# Altium schematic sheet Interface.SchDoc
size Letter
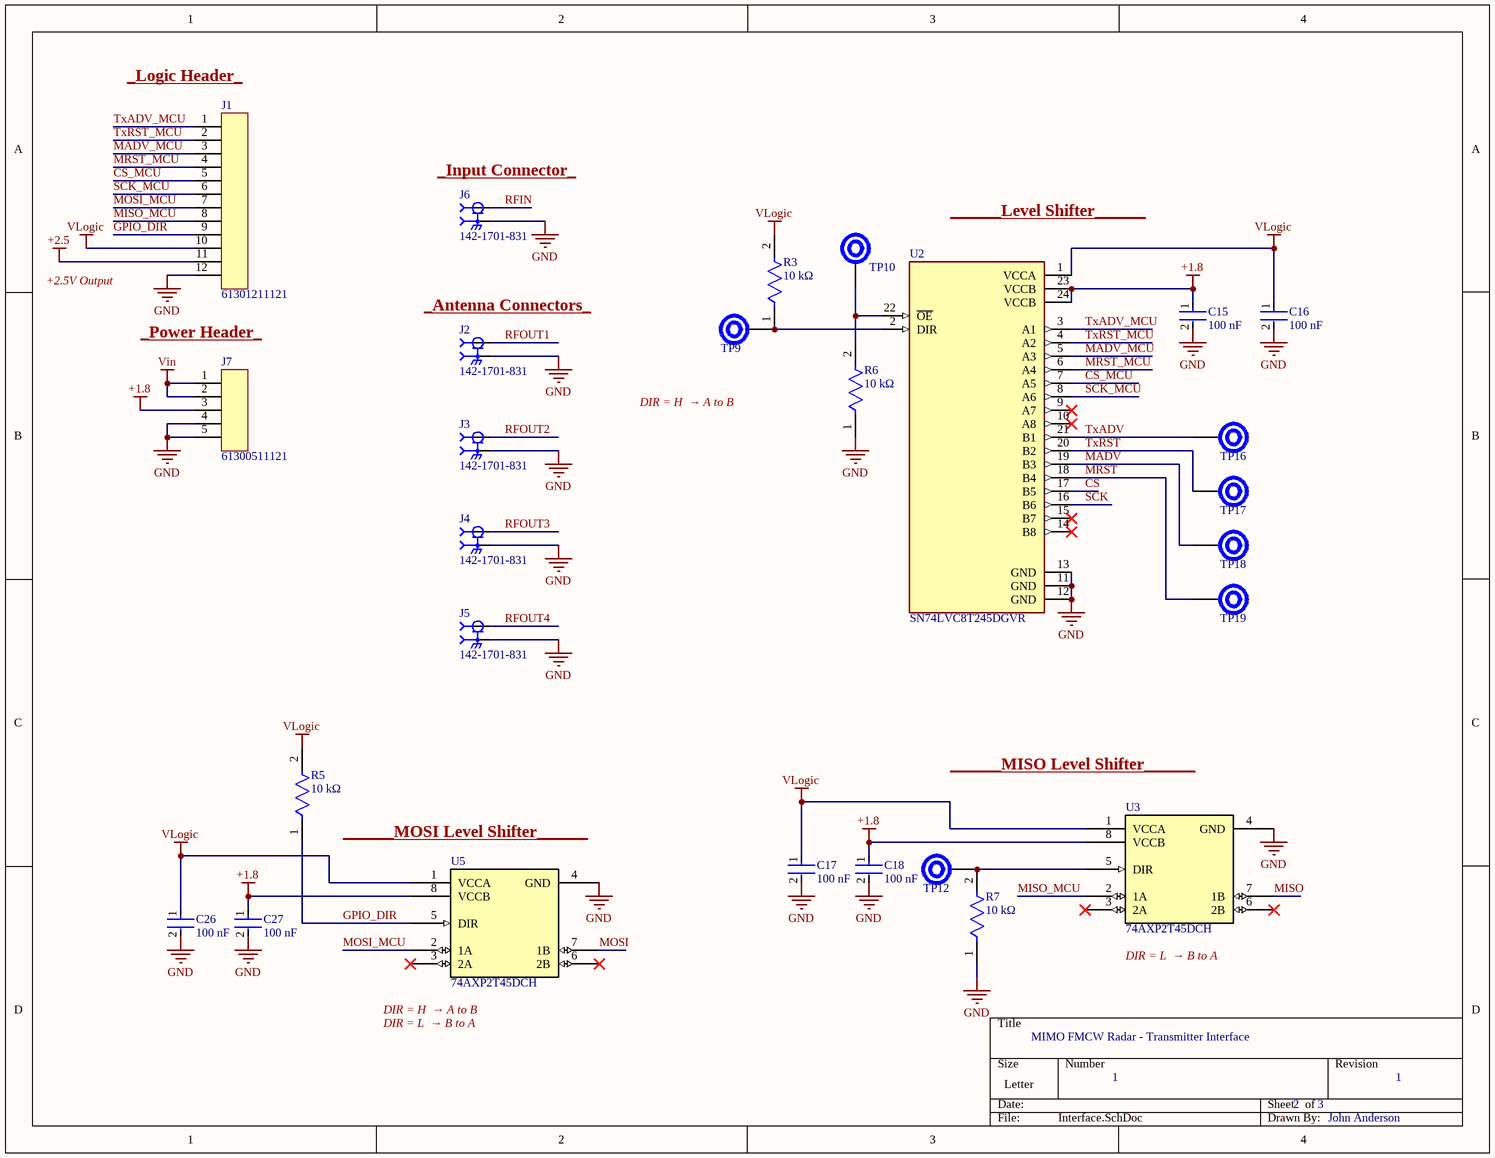
[diagram p0: Interface.SchDoc]

## Parts
C15  100 nF  [FP-CGA3E-0_3-0_1-MFG]
C16  100 nF  [FP-CGA3E-0_3-0_1-MFG]
C17  100 nF  [FP-CGA3E-0_3-0_1-MFG]
C18  100 nF  [FP-CGA3E-0_3-0_1-MFG]
C26  100 nF  [FP-CGA3E-0_3-0_1-MFG]
C27  100 nF  [FP-CGA3E-0_3-0_1-MFG]
J1  61301211121  [61301211121]
J2  142-1701-831  [142-1701-831-Footprint-1]
J3  142-1701-831  [142-1701-831-Footprint-1]
J4  142-1701-831  [142-1701-831-Footprint-1]
J5  142-1701-831  [142-1701-831-Footprint-1]
J6  142-1701-831  [142-1701-831-Footprint-1]
J7  61300511121  [61300511121]
R3  10 kΩ  [FP-RC0603-0_55-IPC_C]
R5  10 kΩ  [FP-RC0603-0_55-IPC_C]
R6  10 kΩ  [FP-RC0603-0_55-IPC_C]
R7  10 kΩ  [FP-RC0603-0_55-IPC_C]
TP9  Test Point - 32 mil  [Test Point - 32 mil-Footprint-1]  (value not drawn)
TP10  Test Point - 32 mil  [Test Point - 32 mil-Footprint-1]  (value not drawn)
TP12  Test Point - 32 mil  [Test Point - 32 mil-Footprint-1]  (value not drawn)
TP16  Test Point - 32 mil  [Test Point - 32 mil-Footprint-1]  (value not drawn)
TP17  Test Point - 32 mil  [Test Point - 32 mil-Footprint-1]  (value not drawn)
TP18  Test Point - 32 mil  [Test Point - 32 mil-Footprint-1]  (value not drawn)
TP19  Test Point - 32 mil  [Test Point - 32 mil-Footprint-1]  (value not drawn)
U2  SN74LVC8T245DGVR  [SN74LVC8T245DGVR-Footprint-1]
U3  74AXP2T45DCH  [74AXP2T45DCH-Footprint-1]
U5  74AXP2T45DCH  [74AXP2T45DCH-Footprint-1]

## Nets
+1.8: C15.1 C18.1 C27.1 J7.3 U2.23(VCCB) U2.24(VCCB) U3.8(VCCB) U5.8(VCCB)
+2.5: J1.11
GND: C15.2 C16.2 C17.2 C18.2 C26.2 C27.2 J1.12 J2.2(GND) J3.2(GND) J4.2(GND) J5.2(GND) J6.2(GND) J7.4 J7.5 R6.1 R7.1 U2.11(GND) U2.12(GND) U2.13(GND) U3.4(GND) U5.4(GND)
Vin: J7.1 J7.2
VLogic: C16.1 C17.1 C26.1 J1.10 R3.2 R5.2 U2.1(VCCA) U3.1(VCCA) U5.1(VCCA)
CS: U2.17(B5)
CS_MCU: J1.5 U2.7(A5)
GPIO_DIR: J1.9 R5.1 U5.5(DIR)
MADV: TP18.1 U2.19(B3)
MADV_MCU: J1.3 U2.5(A3)
MISO: U3.7(1B)
MISO_MCU: J1.8 U3.2(1A)
MOSI: U5.7(1B)
MOSI_MCU: J1.7 U5.2(1A)
MRST: TP19.1 U2.18(B4)
MRST_MCU: J1.4 U2.6(A4)
RFIN: J6.1(SIG)
RFOUT1: J2.1(SIG)
RFOUT2: J3.1(SIG)
RFOUT3: J4.1(SIG)
RFOUT4: J5.1(SIG)
SCK: U2.16(B6)
SCK_MCU: J1.6 U2.8(A6)
TxADV: TP16.1 U2.21(B1)
TxADV_MCU: J1.1 U2.3(A1)
TxRST: TP17.1 U2.20(B2)
TxRST_MCU: J1.2 U2.4(A2)
NetR3_1: R3.1 TP9.1 U2.2(DIR)
NetR6_2: R6.2 TP10.1 U2.22(~{OE})
NetR7_2: R7.2 TP12.1 U3.5(DIR)

Not connected (* = marked no-connect by the designer): U2 9(A7)* 10(A8)* 14(B8)* 15(B7)*; U3 3(2A)* 6(2B)*; U5 3(2A)* 6(2B)*

## Notes on the sheet
- (near J1) _Logic Header_
- (near J6) _Input Connector_
- ______Level Shifter______
- +2.5V Output
- _Power Header_
- (near J2) _Antenna Connectors_
- DIR = H  → A to B
- ______MISO Level Shifter______
- ______MOSI Level Shifter______
- (near U3) DIR = L  → B to A
- DIR = L  → B to A
- (near U5) DIR = H  → A to B
- MIMO FMCW Radar - Transmitter Interface
- 1
- 2
- 3
- John Anderson

## Library data of the parts
C15-C18 C26 C27 = CMP-00054-1: Ceramic Capacitor, Multilayer, Ceramic, 50V, 10% +Tol, 10% -Tol, X7R, 15% TC, 0.1uF, Surface Mount, 0603; Reference Standard: AEC-Q200; Value: 100nF; Multilayer: Yes; Min Operating Temperature: -55°C; Reach SVHC Compliant: Yes; Case/Package: 0603; Width: 0.8mm; Dielectric Material: Ceramic; Pins: 2; JESD-609 Code: e3; Package Style: SMTMeter; Capacitor Type: Ceramic; Mounting Technology: Surface Mount; Tolerance  (fill in as +-): 10%; Max Operating Temperature: 125°C; Packaging: Tape and Reel; Tolerance (fill in as +-): 10%; Terminal Finish: Nickel; Termination: Wraparound; Height: 0.8mm; Temperature Characteristics Code: X7R; Rated DC Voltage (URdc): 50V; Length: 1.6mm; Package Shape: Rectangular; RoHS Compliant: Yes
J1 = CMP-00202-1: THT Vertical Pin Header WR-PHD, Pitch 2.54 mm, Single Row, 12 pins; Number of Positions: 12; Current Rating: 3A; Connector Type: Male Pin; Pitch: 2.54mm; Contact Resistance: 20mΩ; Gender: Male; Operating Supply Voltage: 250V; Color: Black; Contact Plating: Gold; Packaging: Bulk; Mounting Technology: Through Hole; Contact Mating Length: 5.9944mm; Number of Rows: 1; Contact Material: Copper; Number of Contacts: 12; Lead Pitch: 2.54mm; Orientation: Vertical; Pins: 12; Termination: Solder; RoHS: Compliant
J2-J6 = CMP-00382-1: RF SMA Connector, 1 Contact(s), Female, Board Mount, Surface Mount Terminal, Locking, Jack; Polarity: Standard; Insertion Loss (dB): 0.55dB; Insulation Resistance: 1GΩ; Connector Type: SMA, Socket; Body Plating: Gold; Clock Frequency: 26.5GHz; Impedance: 50Ω; Voltage Rating: 170V; Body Material: Brass; Contact Resistance: 4mΩ; Number of Ports: 1; Gender: Male; Dielectric Material: PTFE; Min Operating Temperature: -65°C; Case/Package: SMA; Contact Gender: Female; Shell Material: Brass; RoHS: Compliant; Harmonized Tariff Schedule (HTS) Code: 8536.69.40.10; Introduction Date: 2010-04-24; Orientation: Straight; Lifecycle Status: Production; Contact Material: Copper; Max Operating Temperature: 165°C; Pins: 1; Fastening Type: Threaded; Termination: Solder; Mounting Technology: Edge; Contact Plating: Gold; Export Control Classification Number (ECCN) Code: EAR99; Frequency: 26.5GHz; Housing Color: Gold; REACH SVHC: Yes
J7 = CMP-00200-1: THT Vertical Pin Header WR-PHD, Pitch 2.54 mm, Single Row, 5 pins; Number of Positions: 5; Pitch: 2.54mm; Operating Supply Voltage: 250V; Current Rating: 3A; Contact Resistance: 20mΩ; Gender: Male; Connector Type: Male Pin; Lead Free: Lead Free; Min Operating Temperature: -40°C; Orientation: Vertical; Number of Contacts: 5; Contact Mating Length: 5.9944mm; Pins: 5; Max Operating Temperature: 105°C; Lead Pitch: 2.54mm; RoHS: Compliant; Height: 8.89mm; Voltage Rating: 250V; Mounting Technology: Through Hole; Termination: Solder; Number of Rows: 1; Contact Plating: Gold; Packaging: Bulk; Contact Material: Gold; Color: Black
R3 R5-R7 = CMP-00049-1: Fixed Resistor, Metal Glaze/thick Film, 0.1W, 10000ohm, 75V, 1% +/-Tol, 100ppm/Cel, Surface Mount, 0603; Package Width: 0.8mm; Rated Temperature: 70°C; Temperature Coefficient (ppm/Cel): 100; Package Height: 0.45mm; Power: 100mW; Value: 10kR; Additional Feature: LASER TRIMMABLE; Package Length: 1.6mm; Case/Package: 0603; Termination: Wraparound; Max Operating Temperature: 155°C; Construction: Chip; Mounting Technology: Surface Mount; Packaging: Tape and Reel; RoHS Compliant: Yes; Pins: 2; Working Voltage: 75V; Min Operating Temperature: -55°C; Package Shape: Rectangular; Resistor Type: FIXED RESISTOR; Technology: METAL GLAZE/THICK FILM; Terminal Finish: Nickel; Tolerance: 1%; JESD-609 Code: e3; Reach SVHC Compliant: Yes
TP9 TP10 TP12 TP16-TP19 = CMP-00284-1: 32 mil (0.8 mm) test point.
U2 = CMP-00379-1: IC BUS TRANSCVR 8BIT 24TVSOP / Voltage Level Translator 8-CH Bidirectional 24-Pin TVSOP T/R; Manufacturer Lifecycle Status: ACTIVE; Propagation Delay: 4.2ns; Number of Outputs: 8; Number of Circuits: 1; Topology: Push-Pull; Polarity: Non-Inverting; Data Rate: 500Mbps; Logic Function: Transceiver, Translator; Quiescent Current: 15µA; High Level Output Current: -32mA; Low Level Output Current: 32mA; Operating Supply Voltage: 3.3V; Min Supply Voltage: 1.65V; Turn-On Delay Time: 32.2ns; Max Supply Voltage: 5.5V; Weight: 60.894776mg; Lifecycle Status: Production; Radiation Hardening: No; Length: 5mm; Min Operating Temperature: -40°C; Contact Plating: Gold; Number of Bits: 8; Lead Free: Lead Free; Width: 4.4mm; Termination: SMD/SMT; Height: 1.2mm; Case/Package: TFSOP; Number of Channels: 8; Number of Inputs: 8; Number of Elements: 1; Schedule B: 8542390000; REACH SVHC: No; RoHS: Compliant; Direction: Bidirectional; Packaging: Cut Tape; Number of Transceivers: 8; Pins: 24; Max Operating Temperature: 85°C; Mounting Technology: Surface Mount; Thickness: 1.05mm
U3 U5 = CMP-00336-1: Dual Supply Level Translator 2-bit Bidirectional 0.95V to 5.5V 8-Pin VSSOP; Manufacturer Lifecycle Status: RELEASED FOR SUPPLY; Propagation Delay: 16.5ns; Number of Ports: 2; Operating Supply Voltage: 1.2V; Clock Edge Trigger Type: Positive Edge; Number of Circuits: 1; Low Level Output Current: 12mA; Max Supply Current: 13µA; Load Capacitance: 5pF; Min Supply Voltage: 900mV; Min Operating Temperature: -40°C; Number of Terminals: 8; Number of Bits: 2; Width: 2mm; RoHS: Compliant; Terminal Pitch: 500µm; Introduction Date: 2024-07-25; Number of Channels: 1; Lifecycle Status: Production; China RoHS: Compliant; Max Operating Temperature: 125°C; Max Supply Voltage: 5.5V; Length: 2.3mm; Direction: Bidirectional; Height - Seated (Max): 1mm; Harmonized Tariff Schedule (HTS) Code: 8542.39.00.60; REACH SVHC: Yes